# EAGLE design board (EAGLE 8.0.1)
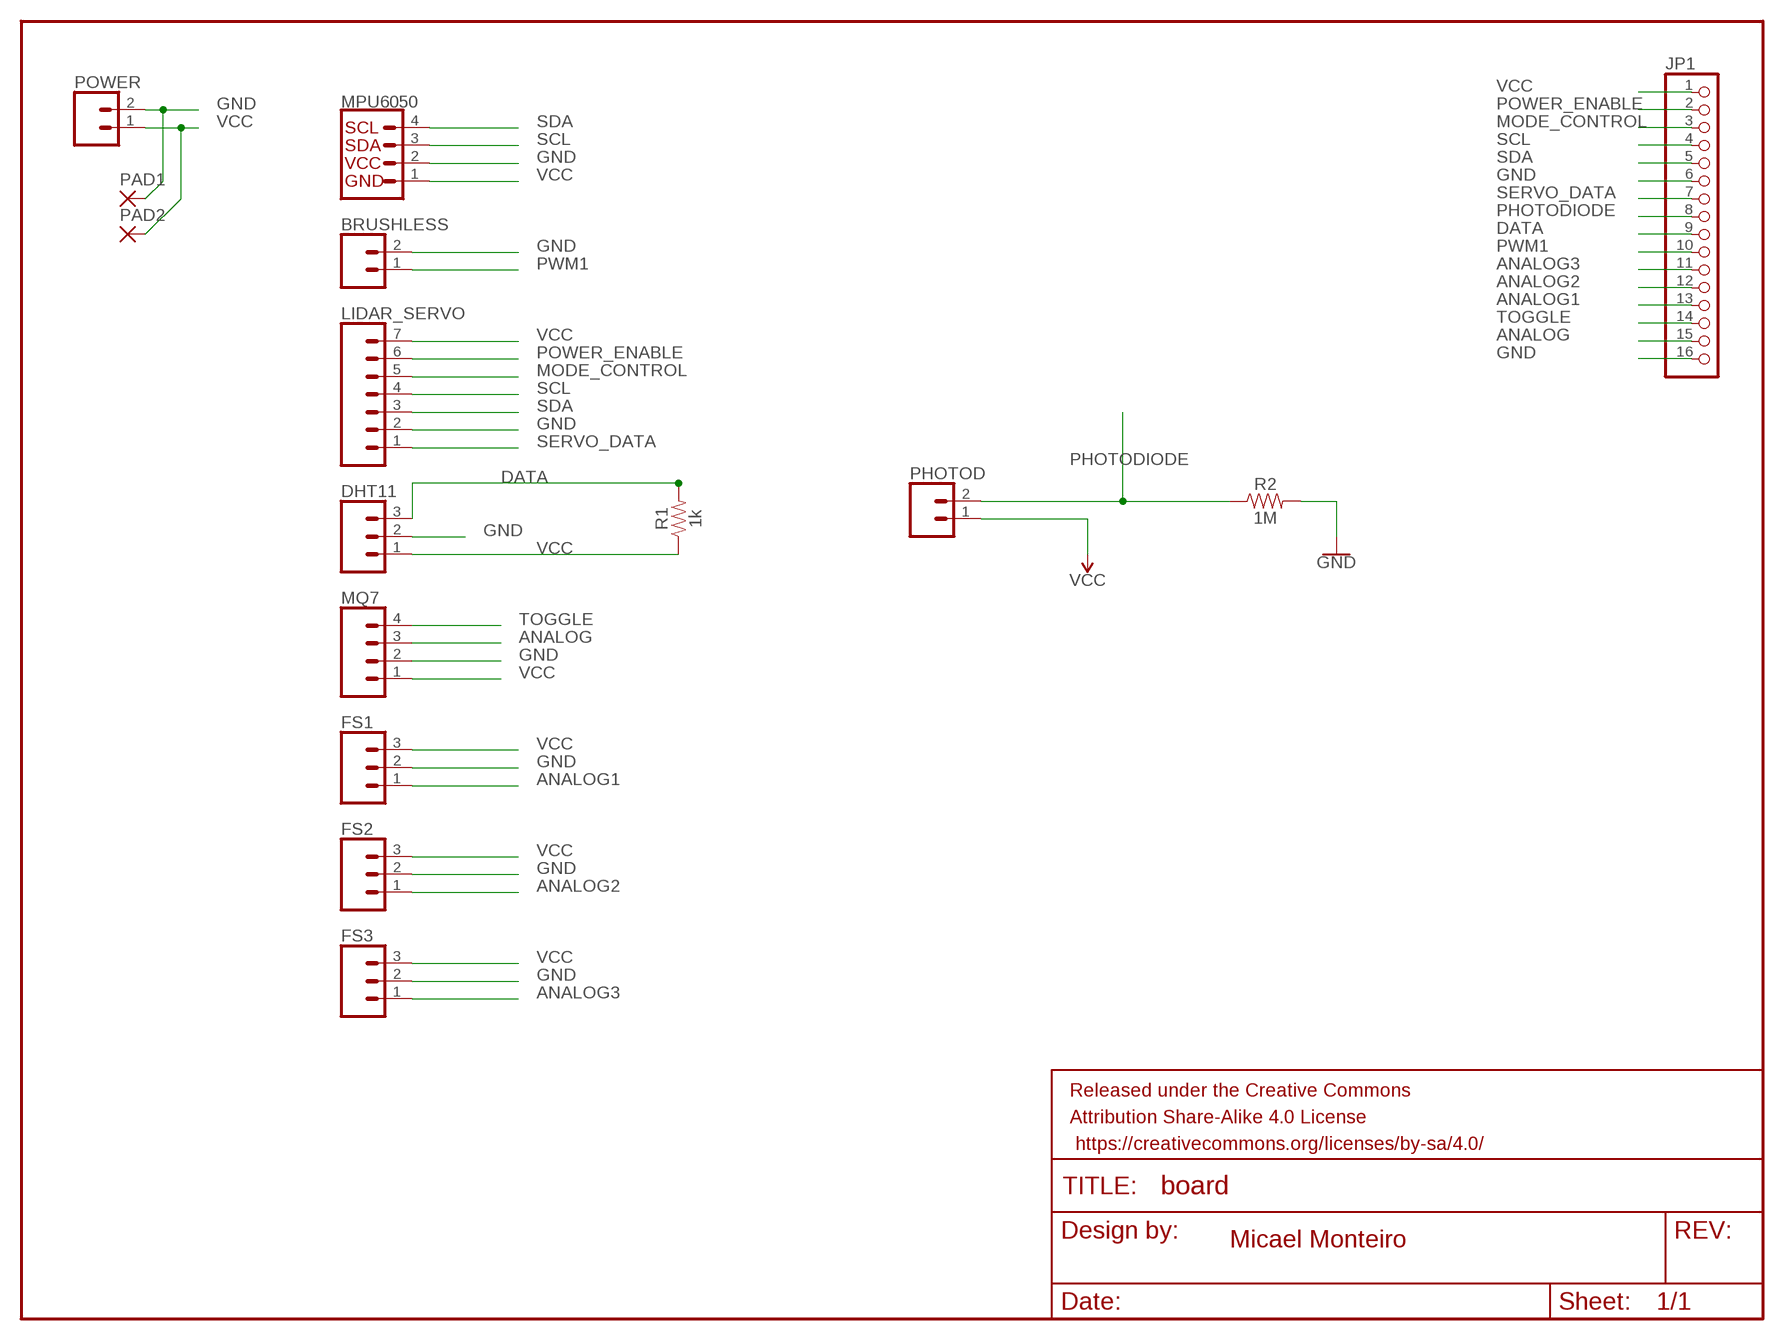
[diagram p0: schematic, sheet 1]

## Parts
BRUSHLESS  CONN_02  [1X02]
DHT11  CONN_03  [1X03]
FRAME1  FRAME-LETTER  [CREATIVE_COMMONS]
FS1  CONN_03  [1X03]
FS2  CONN_03  [1X03]
FS3  CONN_03  [1X03]
JP1  PINHD-1X16  [1X16]
LIDAR_SERVO  CONN_07  [1X07]
MPU6050  I2C_STANDARD  [1X04]
MQ7  CONN_04  [1X04]
PAD1  1,6/0,9  [1,6/0,9]
PAD2  1,6/0,9  [1,6/0,9]
PHOTOD  CONN_02  [1X02]
POWER  CONN_02  [1X02]
R1  1k  1KOHM-0603-1/10W-1%  [0603]
R2  1M  1MOHM-0603-1/4W-5%  [0603]

## Nets
ANALOG: JP1.15 MQ7.3
ANALOG1: FS1.1 JP1.13
ANALOG2: FS2.1 JP1.12
ANALOG3: FS3.1 JP1.11
DATA: DHT11.3 JP1.9 R1.2
GND: BRUSHLESS.2 DHT11.2 FS1.2 FS2.2 FS3.2 JP1.6 JP1.16 LIDAR_SERVO.2 MPU6050.2 MQ7.2 PAD1.1(P) POWER.2 R2.2
MODE_CONTROL: JP1.3 LIDAR_SERVO.5
PHOTODIODE: JP1.8 PHOTOD.2 R2.1
POWER_ENABLE: JP1.2 LIDAR_SERVO.6
PWM1: BRUSHLESS.1 JP1.10
SCL: JP1.4 LIDAR_SERVO.4 MPU6050.3
SDA: JP1.5 LIDAR_SERVO.3 MPU6050.4
SERVO_DATA: JP1.7 LIDAR_SERVO.1
TOGGLE: JP1.14 MQ7.4
VCC: DHT11.1 FS1.3 FS2.3 FS3.3 JP1.1 LIDAR_SERVO.7 MPU6050.1 MQ7.1 PAD2.1(P) PHOTOD.1 POWER.1 R1.1

## Notes on the sheet
- Micael Monteiro

## Library data of the parts
BRUSHLESS PHOTOD POWER = SparkFun-Connectors:CONN_02: Multi connection point. Often used as Generic Header-pin footprint for 0.1 inch spaced/style header connections On any of the 0.1 inch spaced packages, you can populate with these: Break Away Headers - Straight <https://www.sparkfun.com/products/116> (PRT-00116) Break Away Male Headers - Right Angle <https://www.sparkfun.com/products/553> (PRT-00553) Female Headers <https://www.sparkfun.com/products/115> (PRT-00115) Break Away Headers - Machine Pin <https://www.sparkfun.com/products/117> (PRT-00117) Break Away Female Headers - Swiss Machine Pin <https://www.sparkfun.com/products/743> (PRT-00743) For SCREWTERMINALS and SPRING TERMINALS visit here: Screw Terimnals on SparkFun.com <https://www.sparkfun.com/search/results?term=Screw+Terminals> (5mm/3.5mm/2.54mm spacing) This device is also useful as a general connection point to wire up your design to another part of your project. Our various solder wires solder well into these plated through hole pads. Hook-Up Wire - Assortment (Stranded, 22 AWG) <https://www.sparkfun.com/products/11375> (PRT-11375) Hook-Up Wire - Assortment (Solid Core, 22 AWG) <https://www.sparkfun.com/products/11367> (PRT-11367) View the entire wire category on our website here <https://www.sparkfun.com/categories/141> Special notes: Molex polarized connector foot print use with: PRT-08233 with associated crimp pins and housings. 2.54_SCREWTERM for use with PRT-10571. 3.5mm Screw Terminal footprints for PRT-08084 5mm Screw Terminal footprints for use with PRT-08432
DHT11 FS1-FS3 = SparkFun-Connectors:CONN_03: Multi connection point. Often used as Generic Header-pin footprint for 0.1 inch spaced/style header connections On any of the 0.1 inch spaced packages, you can populate with these: Break Away Headers - Straight <https://www.sparkfun.com/products/116> (PRT-00116) Break Away Male Headers - Right Angle <https://www.sparkfun.com/products/553> (PRT-00553) Female Headers <https://www.sparkfun.com/products/115> (PRT-00115) Break Away Headers - Machine Pin <https://www.sparkfun.com/products/117> (PRT-00117) Break Away Female Headers - Swiss Machine Pin <https://www.sparkfun.com/products/743> (PRT-00743) Stackable Header - 3 Pin (Female, 0.1") <https://www.sparkfun.com/products/13875> (PRT-13875) For SCREWTERMINALS and SPRING TERMINALS visit here: Screw Terimnals on SparkFun.com <https://www.sparkfun.com/search/results?term=Screw+Terminals> (5mm/3.5mm/2.54mm spacing) This device is also useful as a general connection point to wire up your design to another part of your project. Our various solder wires solder well into these plated through hole pads. Hook-Up Wire - Assortment (Stranded, 22 AWG) <https://www.sparkfun.com/products/11375> (PRT-11375) Hook-Up Wire - Assortment (Solid Core, 22 AWG) <https://www.sparkfun.com/products/11367> (PRT-11367) View the entire wire category on our website here <https://www.sparkfun.com/categories/141> Special notes: Molex polarized connector foot print use with SKU : PRT-08232 with associated crimp pins and housings.
FRAME1 = SparkFun-Aesthetics:FRAME-LETTER: Schematic Frame - Letter Standard 8.5x11 US Letter frame
JP1 = pinhead:PINHD-1X16: PIN HEADER
LIDAR_SERVO = SparkFun-Connectors:CONN_07: Multi connection point. Often used as Generic Header-pin footprint for 0.1 inch spaced/style header connections On any of the 0.1 inch spaced packages, you can populate with these: Break Away Headers - Straight <https://www.sparkfun.com/products/116> (PRT-00116) Break Away Male Headers - Right Angle <https://www.sparkfun.com/products/553> (PRT-00553) Female Headers <https://www.sparkfun.com/products/115> (PRT-00115) Break Away Headers - Machine Pin <https://www.sparkfun.com/products/117> (PRT-00117) Break Away Female Headers - Swiss Machine Pin <https://www.sparkfun.com/products/743> (PRT-00743) For SCREWTERMINALS and SPRING TERMINALS visit here: Screw Terimnals on SparkFun.com <https://www.sparkfun.com/search/results?term=Screw+Terminals> (5mm/3.5mm/2.54mm spacing) This device is also useful as a general connection point to wire up your design to another part of your project. Our various solder wires solder well into these plated through hole pads. Hook-Up Wire - Assortment (Stranded, 22 AWG) <https://www.sparkfun.com/products/11375> (PRT-11375) Hook-Up Wire - Assortment (Solid Core, 22 AWG) <https://www.sparkfun.com/products/11367> (PRT-11367) View the entire wire category on our website here <https://www.sparkfun.com/categories/141> Special notes: Molex polarized connector foot print use with SKU : PRT-08231 with associated crimp pins and housings. 1MM SMD Version SKU: PRT-10208 NOTES ON THE VARIANTS LOCK and LOCK_LONGPADS... This footprint was designed to help hold the alignment of a through-hole component (i.e. 6-pin header) while soldering it into place. You may notice that each hole has been shifted either up or down by 0.005 of an inch from it's more standard position (which is a perfectly straight line). This slight alteration caused the pins (the squares in the middle) to touch the edges of the holes. Because they are alternating, it causes a "brace" to hold the component in place. 0.005 has proven to be the perfect amount of "off-center" position when using our standard breakaway headers. Although looks a little odd when you look at the bare footprint, once you have a header in there, the alteration is very hard to notice. Also,if you push a header all the way into place, it is covered up entirely on the bottom side.
MPU6050 = SparkFun-Connectors:I2C_STANDARD: SparkFun I2C Standard Pinout Header SparkFun has standardized on a pinout for all I2C based sensor breakouts. This pinout allows I2C boards to be plugged directly into the headers on Arduino Uno compatible boards, and to be daisy chained easily. Example SparkFun Products: SparkFun Atmospheric Sensor Breakout - BME280 <https://www.sparkfun.com/products/13676> SparkFun Altitude/Pressure Sensor Breakout - MPL3115A2 <https://www.sparkfun.com/products/11084> SparkFun TOF Range Finder Sensor - VL6180 <https://www.sparkfun.com/products/12785>
MQ7 = SparkFun-Connectors:CONN_04: Multi connection point. Often used as Generic Header-pin footprint for 0.1 inch spaced/style header connections On any of the 0.1 inch spaced packages, you can populate with these: Break Away Headers - Straight <https://www.sparkfun.com/products/116> (PRT-00116) Break Away Male Headers - Right Angle <https://www.sparkfun.com/products/553> (PRT-00553) Female Headers <https://www.sparkfun.com/products/115> (PRT-00115) Break Away Headers - Machine Pin <https://www.sparkfun.com/products/117> (PRT-00117) Break Away Female Headers - Swiss Machine Pin <https://www.sparkfun.com/products/743> (PRT-00743) For SCREWTERMINALS and SPRING TERMINALS visit here: Screw Terimnals on SparkFun.com <https://www.sparkfun.com/search/results?term=Screw+Terminals> (5mm/3.5mm/2.54mm spacing) This device is also useful as a general connection point to wire up your design to another part of your project. Our various solder wires solder well into these plated through hole pads. Hook-Up Wire - Assortment (Stranded, 22 AWG) <https://www.sparkfun.com/products/11375> (PRT-11375) Hook-Up Wire - Assortment (Solid Core, 22 AWG) <https://www.sparkfun.com/products/11367> (PRT-11367) View the entire wire category on our website here <https://www.sparkfun.com/categories/141> Special notes: Molex polarized connector foot print use with SKU : PRT-08231 with associated crimp pins and housings. 1MM SMD Version SKU: PRT-10208; PROD_ID: CONN-09696
PAD1 PAD2 = wirepad:1,6/0,9: THROUGH-HOLE PAD
R1 = SparkFun-Resistors:1KOHM: 1kΩ resistor A resistor is a passive two-terminal electrical component that implements electrical resistance as a circuit element. Resistors act to reduce current flow, and, at the same time, act to lower voltage levels within circuits. - Wikipedia; PROD_ID: RES-07856
R2 = SparkFun-Resistors:1MOHM: 1MΩ resistor A resistor is a passive two-terminal electrical component that implements electrical resistance as a circuit element. Resistors act to reduce current flow, and, at the same time, act to lower voltage levels within circuits. - Wikipedia; PROD_ID: RES-07868

## Board
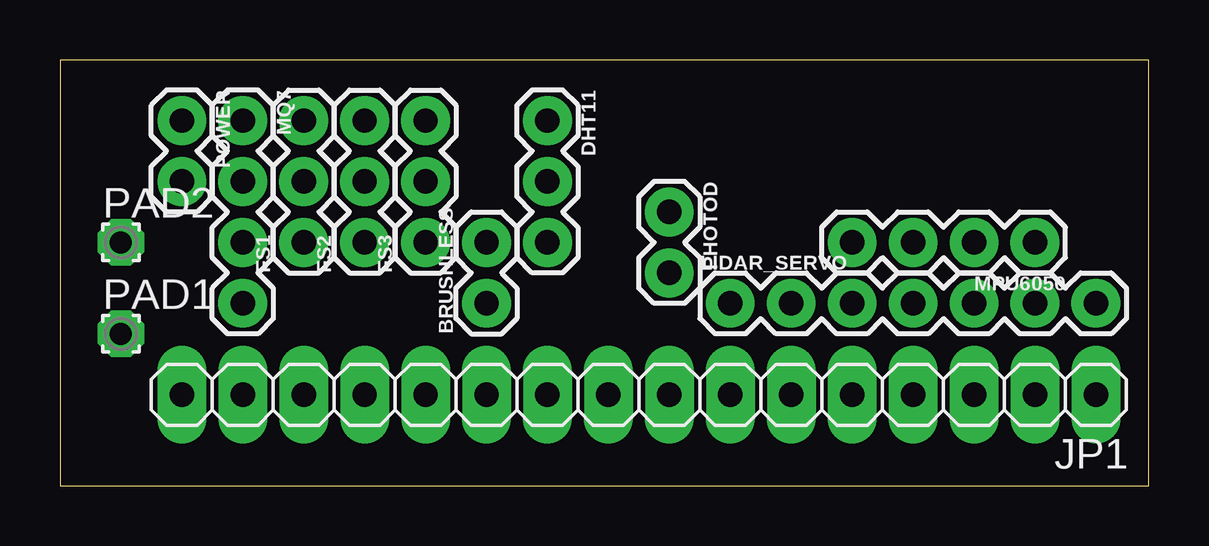
[diagram p1: board, top side]
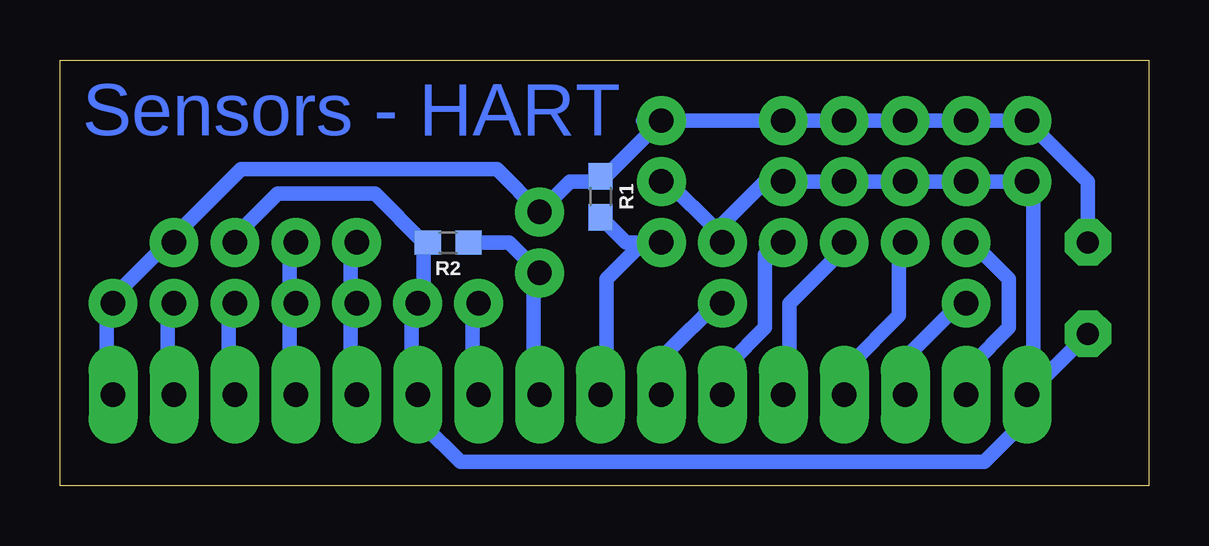
[diagram p2: board, bottom side, seen from below]

Size 45.39 x 17.77 mm. Coordinates in mm from the lower left corner, seen from the top.
Outline: 0,0 45.39,0 45.39,17.77 0,17.77 0,0
Copper layers (1*16): Top 0.035mm / dielectric 1.5mm / Bottom 0.035mm
Design rules "LabE": minimum track width 24mil, minimum drill 1mm, track to track 16mil, track to pad 16mil, pad to pad 16mil, via to via 16mil, smd to smd 8mil, copper to edge 20mil, drill to drill 8mil, minimum pad ring 20mil, minimum via ring 8mil, stop-mask expansion 4mil, vias tented up to drill 0mil, thermal gap 10mil

### Footprints (pad centres in the part's own frame; a part is rotated, then mirrored left to right if it is on the bottom)
1X02 = drill 1.016 pad 1.88: 1 0,0; 2 2.54,0
1X03 = drill 1.016 pad 1.88: 1 0,0; 2 2.54,0; 3 5.08,0
1X16 = drill 1.016 long: 1 -19.05,0; 2 -16.51,0; 3 -13.97,0; 4 -11.43,0; 5 -8.89,0; 6 -6.35,0; 7 -3.81,0; 8 -1.27,0; 9 1.27,0; 10 3.81,0; 11 6.35,0; 12 8.89,0; 13 11.43,0; 14 13.97,0; 15 16.51,0; 16 19.05,0
1X07 = drill 1.016 pad 1.88: 1 0,0; 2 2.54,0; 3 5.08,0; 4 7.62,0; 5 10.16,0; 6 12.7,0; 7 15.24,0
1X04 = drill 1.016 pad 1.88: 1 0,0; 2 2.54,0; 3 5.08,0; 4 7.62,0
1,6/0,9 = drill 0.914 pad 1.6 octagon: 1 0,0
0603 = smd 1.1 x 1: 1 -0.85,0; 2 0.85,0

### Placement (x,y rotation side)
BRUSHLESS  17.78,7.62 90 top
DHT11  20.32,15.24 270 top
FRAME1  -101.6,1.27 0 top  (outside the outline)
FS1  10.16,10.16 90 top
FS2  12.7,10.16 90 top
FS3  15.24,10.16 90 top
JP1  24.13,3.81 180 top
LIDAR_SERVO  27.94,7.62 0 top
MPU6050  40.64,10.16 180 top
MQ7  7.62,15.24 270 top
PAD1  2.54,6.35 0 top
PAD2  2.54,10.16 0 top
PHOTOD  25.4,11.43 270 top
POWER  5.08,15.24 270 top
R1  22.86,12.06 270 bottom
R2  29.21,10.16 180 bottom

### Tracks (layer width: path | path; a pad name or v marks a point on that pad's centre or on a via)
ANALOG
  Bottom 0.61: JP1.15 7.37,4.06 7.37,5.08 5.84,6.6 5.84,8.64 7.37,10.16 MQ7.3
ANALOG1
  Bottom 0.61: FS1.1 10.41,10.16 10.41,7.11 12.45,5.08 12.45,4.06 JP1.13
ANALOG2
  Bottom 0.61: JP1.12 14.99,4.06 14.99,7.62 12.45,10.16 FS2.1
ANALOG3
  Bottom 0.61: JP1.11 17.53,4.06 17.53,5.08 16,6.6 16,9.65 15.49,10.16 FS3.1
DATA
  Bottom 0.61: 21.08,10.16 DHT11.3 20.57,10.16 | 21.08,10.16 22.61,8.64 22.61,4.06 JP1.9 | R1.2 21.8,10.16 21.08,10.16
GND
  Bottom 0.61: 30.23,10.16 30.23,7.62 LIDAR_SERVO.2 30.73,7.62 30.73,4.06 JP1.6 30.23,3.56 30.23,2.54 28.7,1.02 6.86,1.02 5.33,2.54 5.33,3.56 JP1.16 | 30.23,10.16 32.26,12.19 36.32,12.19 37.85,10.67 37.85,10.16 MPU6050.2 | 30.23,10.16 R2.2 | 18.03,10.67 18.03,10.16 BRUSHLESS.2 18.03,10.67 | 18.03,10.67 20.07,12.7 DHT11.2 | JP1.16 4.83,4.06 4.83,12.7 POWER.2 MQ7.2 FS1.2 FS2.2 FS3.2 16,12.7 18.03,10.67 | JP1.16 PAD1.1
MODE_CONTROL
  Bottom 0.61: JP1.3 38.35,4.06 38.35,7.62 LIDAR_SERVO.5
PHOTODIODE
  Bottom 0.61: R2.1 26.67,10.16 PHOTOD.2 25.65,8.64 25.65,4.06 JP1.8
POWER_ENABLE
  Bottom 0.61: JP1.2 40.89,4.06 40.89,7.62 LIDAR_SERVO.6
PWM1
  Bottom 0.61: BRUSHLESS.1 18.03,7.62 20.07,5.59 20.07,4.06 JP1.10
SCL
  Bottom 0.61: 35.81,7.62 35.81,4.06 JP1.4 | 35.81,7.62 35.81,10.16 MPU6050.3 | 35.81,7.62 LIDAR_SERVO.4
SDA
  Bottom 0.61: 33.27,7.62 33.27,4.06 JP1.5 | 33.27,7.62 33.27,10.16 MPU6050.4 | 33.27,7.62 LIDAR_SERVO.3
SERVO_DATA
  Bottom 0.61: JP1.7 28.19,4.06 28.19,7.62 LIDAR_SERVO.1
TOGGLE
  Bottom 0.61: MQ7.4 7.87,7.62 9.91,5.59 9.91,4.06 JP1.14
VCC
  Bottom 0.61: 43.43,7.62 43.43,4.06 JP1.1 | 43.43,7.62 40.89,10.16 MPU6050.1 40.39,10.16 40.39,10.67 37.85,13.21 27.18,13.21 PHOTOD.1 24.13,12.7 23.07,12.7 R1.1 22.64,12.91 DHT11.1 | 43.43,7.62 LIDAR_SERVO.7 | 21.08,15.24 DHT11.1 | DHT11.1 FS3.3 FS2.3 FS1.3 MQ7.1 POWER.1 2.54,12.7 PAD2.1

### Text on the board
Bottom: Sensors - HART